# EAGLE schematic Sendor_Board (EAGLE 7.2.0)
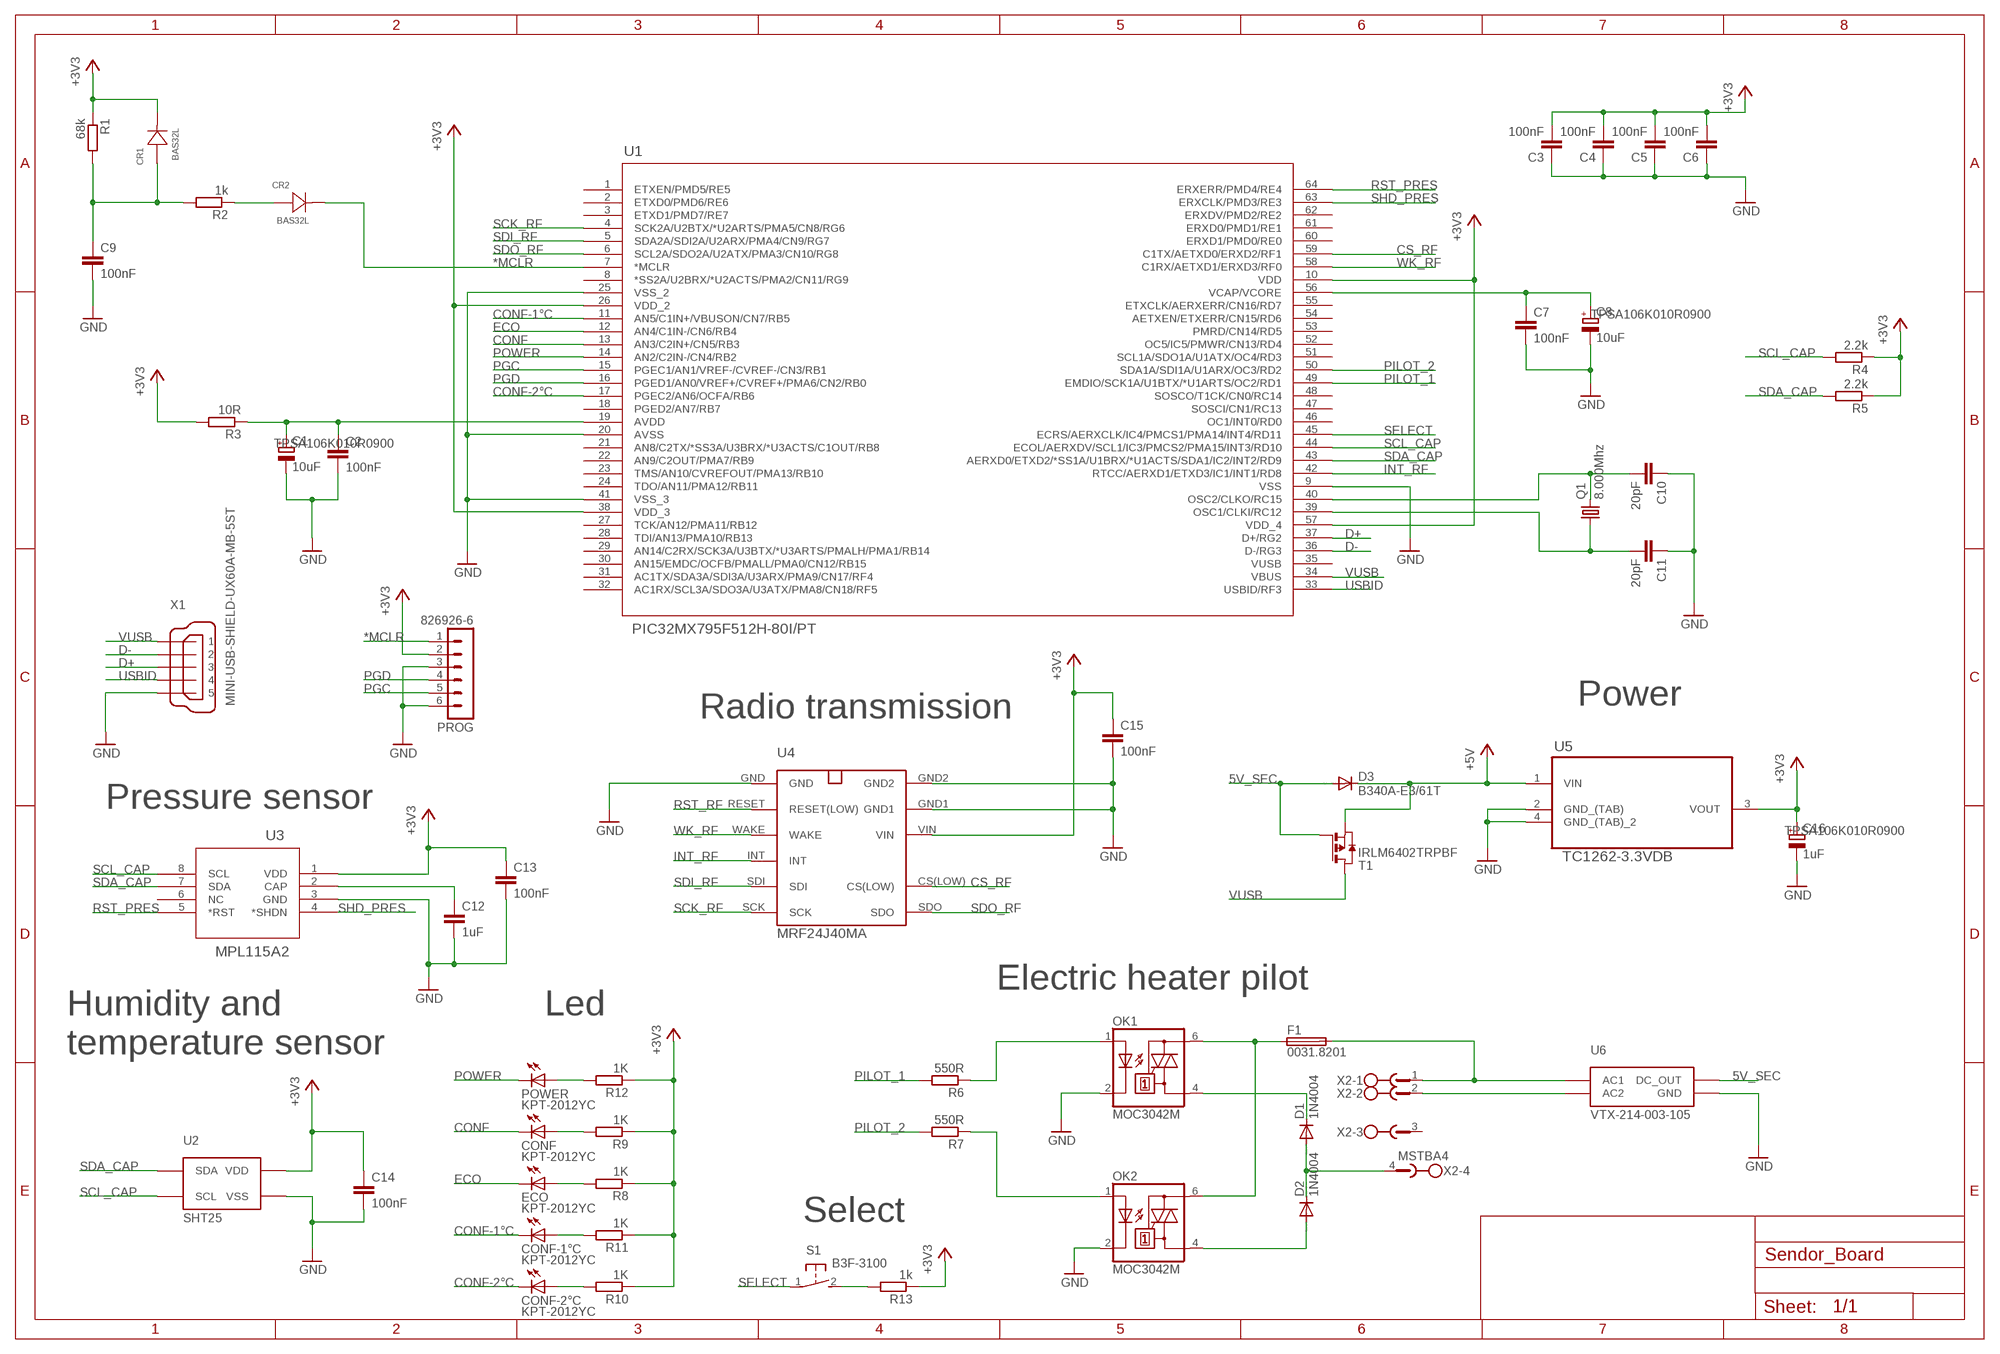
[diagram p0: schematic, sheet 1]

## Parts
C1  10uF  CPOL-EUA/3216-18W  [A/3216-18W]
C2  100nF  C-EUC1206K  [C1206K]
C3  100nF  C-EUC1206K  [C1206K]
C4  100nF  C-EUC1206K  [C1206K]
C5  100nF  C-EUC1206K  [C1206K]
C6  100nF  C-EUC1206K  [C1206K]
C7  100nF  C-EUC1206K  [C1206K]
C8  10uF  CPOL-EUA/3216-18W  [A/3216-18W]
C9  100nF  C-EUC1206K  [C1206K]
C10  20pF  C-EUC1206K  [C1206K]
C11  20pF  C-EUC1206K  [C1206K]
C12  1uF  C-EUC1206K  [C1206K]
C13  100nF  C-EUC1206K  [C1206K]
C14  100nF  C-EUC1206K  [C1206K]
C15  100nF  C-EUC1206K  [C1206K]
C16  1uF  CPOL-EUA/3216-18W  [A/3216-18W]
CONF  KPT-2012YC  LEDCHIP-LED0805  [CHIP-LED0805]
CONF-1°C  KPT-2012YC  LEDCHIP-LED0805  [CHIP-LED0805]
CONF-2°C  KPT-2012YC  LEDCHIP-LED0805  [CHIP-LED0805]
CR1  BAS32L  [SOD80C]
CR2  BAS32L  [SOD80C]
D1  1N4004  [DO41-10]
D2  1N4004  [DO41-10]
D3  B340A-E3/61T  DIODE-DO214AC  [DO214AC]
ECO  KPT-2012YC  LEDCHIP-LED0805  [CHIP-LED0805]
F1  0031.8201  SH22,5  [SH22,5]
OK1  MOC3042M  [DIL06]
OK2  MOC3042M  [DIL06]
POWER  KPT-2012YC  LEDCHIP-LED0805  [CHIP-LED0805]
PROG  826926-6  MA06-1  [MA06-1]
Q1  8.000Mhz  FQ7050B-8.000  [FQ7050B]
R1  68k  R-EU_R1206  [R1206]
R2  1k  R-EU_R1206  [R1206]
R3  10R  R-EU_R1206  [R1206]
R4  2.2k  R-EU_R1206  [R1206]
R5  2.2k  R-EU_R1206  [R1206]
R6  550R  R-EU_R1206  [R1206]
R7  550R  R-EU_R1206  [R1206]
R8  1K  R-EU_R1206  [R1206]
R9  1K  R-EU_R1206  [R1206]
R10  1K  R-EU_R1206  [R1206]
R11  1K  R-EU_R1206  [R1206]
R12  1K  R-EU_R1206  [R1206]
R13  1k  R-EU_R1206  [R1206]
S1  B3F-3100  31-XX  [B3F-31XX]
T1  IRLM6402TRPBF  PMOSSOT23  [SOT-23]
U1  PIC32MX795F512H-80I/PT  [TQFP64_10X10MC-M]
U2  SHT25  [SHT25]
U3  MPL115A2  [LGA8]
U4  MRF24J40MA  [MRF24J40MA]
U5  TC1262-3.3VDB  [SOT230P700X180-4N]
U6  VTX-214-003-105  [VTX-214-003-105]
X1  MINI-USB-SHIELD-UX60A-MB-5ST  [UX60A-MB-5ST]
X2  MSTBA4  [MSTBA4]

## Nets
5V_SEC: D3.A T1.3(G) U6.P$3(DC_OUT)
*MCLR: CR2.1(CATHODE) PROG.1 U1.7(*MCLR)
+3V3: C3.2 C4.2 C5.2 C6.2 C13.1 C14.1 C15.1 C16.+ CR1.1(CATHODE) PROG.2 R1.1 R3.2 R4.1 R5.1 R8.1 R9.1 R10.1 R11.1 R12.1 R13.1 U1.10(VDD) U1.26(VDD_2) U1.38(VDD_3) U1.57(VDD_4) U2.P$5(VDD) U3.1(VDD) U4.VIN U5.3(VOUT)
+5V: D3.C T1.2(S) U5.1(VIN)
CONF: CONF.C U1.13(AN3/C2IN+/CN5/RB3)
CONF-1°C: CONF-1°C.C U1.11(AN5/C1IN+/VBUSON/CN7/RB5)
CONF-2°C: CONF-2°C.C U1.17(PGEC2/AN6/OCFA/RB6)
CS_RF: U1.59(C1TX/AETXD0/ERXD2/RF1) U4.CS(LOW)
D+: U1.37(D+/RG2) X1.3
D-: U1.36(D-/RG3) X1.2
ECO: ECO.C U1.12(AN4/C1IN-/CN6/RB4)
GND: C1.- C2.2 C3.1 C4.1 C5.1 C6.1 C7.2 C8.- C9.2 C10.1 C11.1 C12.2 C13.2 C14.2 C15.2 C16.- OK1.2(C) OK2.2(C) PROG.3 PROG.6 U1.9(VSS) U1.20(AVSS) U1.25(VSS_2) U1.41(VSS_3) U2.P$2(VSS) U3.3(GND) U4.GND U4.GND1 U4.GND2 U5.2(GND_(TAB)) U5.4(GND_(TAB)_2) U6.P$4(GND) X1.5
INT_RF: U1.42(RTCC/AERXD1/ETXD3/IC1/INT1/RD8) U4.INT
N$1: C7.1 C8.+ U1.56(VCAP/VCORE)
N$2: C9.1 CR1.2(ANODE) R1.2 R2.2
N$3: C10.2 Q1.3 U1.40(OSC2/CLKO/RC15)
N$4: C1.+ C2.1 R3.1 U1.19(AVDD)
N$5: CR2.2(ANODE) R2.1
N$6: CONF-2°C.A R10.2
N$7: C11.2 Q1.1 U1.39(OSC1/CLKI/RC12)
N$8: OK1.1(A) R6.1
N$9: OK2.1(A) R7.1
N$10: F1.1 OK1.6(A2) OK2.6(A2)
N$11: F1.2 U6.P$1(AC1) X2.1
N$12: D1.C OK1.4(A1)
N$13: C12.1 U3.2(CAP)
N$14: D2.A OK2.4(A1)
N$15: D1.A D2.C X2.4
N$16: CONF-1°C.A R11.2
N$17: U6.P$2(AC2) X2.2
N$18: ECO.A R8.2
N$19: CONF.A R9.2
N$20: POWER.A R12.2
N$21: R13.2 S1.2(S)
PGC: PROG.5 U1.15(PGEC1/AN1/VREF-/CVREF-/CN3/RB1)
PGD: PROG.4 U1.16(PGED1/AN0/VREF+/CVREF+/PMA6/CN2/RB0)
PILOT_1: R6.2 U1.49(EMDIO/SCK1A/U1BTX/*U1ARTS/OC2/RD1)
PILOT_2: R7.2 U1.50(SDA1A/SDI1A/U1ARX/OC3/RD2)
POWER: POWER.C U1.14(AN2/C2IN-/CN4/RB2)
RST_PRES: U1.64(ERXERR/PMD4/RE4) U3.5(*RST)
RST_RF: U4.RESET(RESET(LOW))
SCK_RF: U1.4(SCK2A/U2BTX/*U2ARTS/PMA5/CN8/RG6) U4.SCK
SCL_CAP: R4.2 U1.44(ECOL/AERXDV/SCL1/IC3/PMCS2/PMA15/INT3/RD10) U2.P$6(SCL) U3.8(SCL)
SDA_CAP: R5.2 U1.43(AERXD0/ETXD2/*SS1A/U1BRX/*U1ACTS/SDA1/IC2/INT2/RD9) U2.P$1(SDA) U3.7(SDA)
SDI_RF: U1.5(SDA2A/SDI2A/U2ARX/PMA4/CN9/RG7) U4.SDI
SDO_RF: U1.6(SCL2A/SDO2A/U2ATX/PMA3/CN10/RG8) U4.SDO
SELECT: S1.1(P) U1.45(ECRS/AERXCLK/IC4/PMCS1/PMA14/INT4/RD11)
SHD_PRES: U1.63(ERXCLK/PMD3/RE3) U3.4(*SHDN)
USBID: U1.33(USBID/RF3) X1.4
VUSB: T1.1(D) U1.34(VBUS) X1.1
WK_RF: U1.58(C1RX/AETXD1/ERXD3/RF0) U4.WAKE
Unconnected: U1.1(ETXEN/PMD5/RE5) U1.2(ETXD0/PMD6/RE6) U1.3(ETXD1/PMD7/RE7) U1.8(*SS2A/U2BRX/*U2ACTS/PMA2/CN11/RG9) U1.18(PGED2/AN7/RB7) U1.21(AN8/C2TX/*SS3A/U3BRX/*U3ACTS/C1OUT/RB8) U1.22(AN9/C2OUT/PMA7/RB9) U1.23(TMS/AN10/CVREFOUT/PMA13/RB10) U1.24(TDO/AN11/PMA12/RB11) U1.27(TCK/AN12/PMA11/RB12) U1.28(TDI/AN13/PMA10/RB13) U1.29(AN14/C2RX/SCK3A/U3BTX/*U3ARTS/PMALH/PMA1/RB14) U1.30(AN15/EMDC/OCFB/PMALL/PMA0/CN12/RB15) U1.31(AC1TX/SDA3A/SDI3A/U3ARX/PMA9/CN17/RF4) U1.32(AC1RX/SCL3A/SDO3A/U3ATX/PMA8/CN18/RF5) U1.46(OC1/INT0/RD0) U1.47(SOSCI/CN1/RC13) U1.48(SOSCO/T1CK/CN0/RC14) U1.51(SCL1A/SDO1A/U1ATX/OC4/RD3) U1.52(OC5/IC5/PMWR/CN13/RD4) U1.53(PMRD/CN14/RD5) U1.54(AETXEN/ETXERR/CN15/RD6) U1.55(ETXCLK/AERXERR/CN16/RD7) U1.60(ERXD1/PMD0/RE0) U1.61(ERXD0/PMD1/RE1) U1.62(ERXDV/PMD2/RE2) U3.6(NC) X1.M1(S1) X1.M2(S2) X1.M3(S3) X1.M4(S4) X2.3

## Notes on the sheet
- Power
- Radio transmission
- Pressure sensor
- Electric heater pilot
- Led
- Humidity and 
  temperature sensor
- Select

## Power pins joined to a net without a drawn wire
VUSB: U1.35(VUSB)

## Library data of the parts
C1 C8 C16 = resistor:CPOL-EU: POLARIZED CAPACITOR, European symbol; TYPE: TPSA106K010R0900
C2-C7 C9-C15 = resistor:C-EU: CAPACITOR, European symbol
CONF CONF-1°C CONF-2°C ECO POWER = led:LED: LED OSRAM: - CHIPLED LG R971, LG N971, LY N971, LG Q971, LY Q971, LO R971, LY R971 LH N974, LH R974 LS Q976, LO Q976, LY Q976 LO Q996 - Hyper CHIPLED LW Q18S LB Q993, LB Q99A, LB R99A - SideLED LS A670, LO A670, LY A670, LG A670, LP A670 LB A673, LV A673, LT A673, LW A673 LH A674 LY A675 LS A676, LA A676, LO A676, LY A676, LW A676 LS A679, LY A679, LG A679 - Hyper Micro SIDELED® LS Y876, LA Y876, LO Y876, LY Y876 LT Y87S - SmartLED LW L88C, LW L88S LB L89C, LB L89S, LG L890 LS L89K, LO L89K, LY L89K LS L896, LA L896, LO L896, LY L896 - TOPLED LS T670, LO T670, LY T670, LG T670, LP T670 LSG T670, LSP T670, LSY T670, LOP T670, LYG T670 LG T671, LOG T671, LSG T671 LB T673, LV T673, LT T673, LW T673 LH T674 LS T676, LA T676, LO T676, LY T676, LB T676, LH T676, LSB T676, LW T676 LB T67C, LV T67C, LT T67C, LS T67K, LO T67K, LY T67K, LW E67C LS E67B, LA E67B, LO E67B, LY E67B, LB E67C, LV E67C, LT E67C LW T67C LS T679, LY T679, LG T679 LS T770, LO T770, LY T770, LG T770, LP T770 LB T773, LV T773, LT T773, LW T773 LH T774 LS E675, LA E675, LY E675, LS T675 LS T776, LA T776, LO T776, LY T776, LB T776 LHGB T686 LT T68C, LB T68C - Hyper Mini TOPLED® LB M676 - Mini TOPLED Santana® LG M470 LS M47K, LO M47K, LY M47K Source: http://www.osram.convergy.de LUXEON: - LUMILED® LXK2-PW12-R00, LXK2-PW12-S00, LXK2-PW14-U00, LXK2-PW14-V00 LXK2-PM12-R00, LXK2-PM12-S00, LXK2-PM14-U00 LXK2-PE12-Q00, LXK2-PE12-R00, LXK2-PE12-S00, LXK2-PE14-T00, LXK2-PE14-U00 LXK2-PB12-K00, LXK2-PB12-L00, LXK2-PB12-M00, LXK2-PB14-N00, LXK2-PB14-P00, LXK2-PB14-Q00 LXK2-PR12-L00, LXK2-PR12-M00, LXK2-PR14-Q00, LXK2-PR14-R00 LXK2-PD12-Q00, LXK2-PD12-R00, LXK2-PD12-S00 LXK2-PH12-R00, LXK2-PH12-S00 LXK2-PL12-P00, LXK2-PL12-Q00, LXK2-PL12-R00 Source: www.luxeon.com KINGBRIGHT: KA-3528ASYC Source: www.kingbright.com
CR1 CR2 = pfo:BAS32L; MANUFACTURER_PART_NUMBER: bas32l; VENDOR: NXP
D1 D2 = diode:1N4004: DIODE general purpose rectifier, 1 A
D3 = diode:DIODE-: DIODE
F1 = fuse:SH22,5: FUSE HOLDER grid 22,5 mm, OGN0031 8201, Schurter (Buerklin); MF: SCHURTER; MPN: 0031.8201; OC_FARNELL: 1162740; OC_NEWARK: 96F8317
OK1 OK2 = optocoupler:MOC30*: 6-Pin DIP Zero-Cross Optoisolators Triac Driver Output (250/400 Volt Peak) Source: Data sheet <http://www.fairchildsemi.com/ds/MO/MOC3031M.pdf> The old path of data sheet not more available 2013-05-06.; MF: FAIRCHILD SEMICONDUCTOR; MPN: MOC3042-M; OC_FARNELL: 1021368; OC_NEWARK: 72K8899
PROG = con-lstb:MA06-1: PIN HEADER; OC_FARNELL: unknown; OC_NEWARK: unknown
Q1 = pfo:FQ7050B-8.000: kHz RANGE CRYSTAL UNIT LOW PROFILE SMD Source: Epson Toyocom FC-12M.pdf
R1-R13 = resistor:R-EU_: RESISTOR, European symbol
S1 = switch-omron:31-XX: OMRON SWITCH; MPN: B3F-3100; OC_FARNELL: 959704; OC_NEWARK: 36M3582
T1 = zetex:PMOSSOT23: MOS FET; OC_FARNELL: unknown; OC_NEWARK: unknown
U1 = pfo:PIC32MX795F512H-80I/PT
U2 = pfo:SHT25
U3 = pfo:MPL115A2; MANUFACTURER_PART_NUMBER: mpl115a2; VENDOR: Freescale
U4 = pfo:MRF24J40MA
U5 = pfo:TC1262-3.3VDB: IC, 500mA Fixed Output CMOS LDO,3.3V,SOT-223, 3-lead; MPN: TC1262-3.3VDB; OC_FARNELL: 1852183; OC_NEWARK: 53R0370; PACKAGE: SOT-223-3; SUPPLIER: Microchip
U6 = pfo:VTX-214-003-105
X1 = con-hirose:MINI-USB-SHIELD-: MINI USB Connector Source: http://www.hirose.co.jp/cataloge_hp/e24000019.pdf; OC_FARNELL: unknown; OC_NEWARK: unknown
X2 = con-phoenix-508:MSTBA4: PHOENIX; MF: FARNELL; MPN: 1757268; OC_FARNELL: 3705195; OC_NEWARK: 71C4163